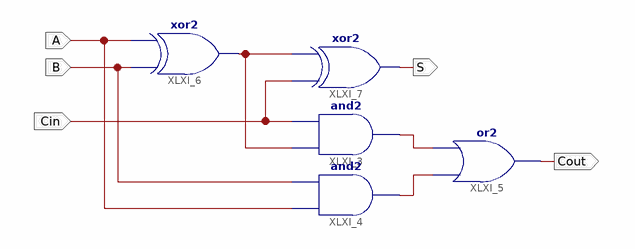
[diagram p0: schematic sheet 1]
// Xilinx ISE schematic full_adder.sch (virtex6) as structural Verilog: 5 symbols, 5 ports
module full_adder (
  input  A,
  input  B,
  input  Cin,
  output S,
  output Cout
);

  wire XLXN_2, XLXN_9, XLXN_10;

  and XLXI_3 (XLXN_9, XLXN_2, Cin);
  and XLXI_4 (XLXN_10, A, B);
  or XLXI_5 (Cout, XLXN_10, XLXN_9);
  xor XLXI_6 (XLXN_2, B, A);
  xor XLXI_7 (S, Cin, XLXN_2);
endmodule
